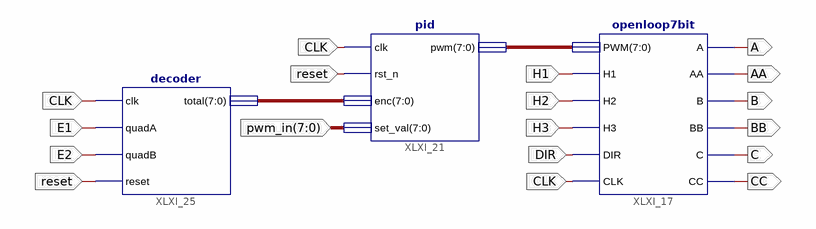
[diagram p0: schematic sheet 1]
// Xilinx ISE schematic my_protocol_7bit_pid.sch (spartan6) as structural Verilog: 3 symbols, 15 ports
module my_protocol_7bit_pid (
  input  [7:0] pwm_in,
  input  CLK,
  input  reset,
  input  DIR,
  input  H3,
  input  H2,
  input  H1,
  input  E2,
  input  E1,
  output CC,
  output C,
  output BB,
  output B,
  output AA,
  output A
);

  wire [7:0] XLXN_16, XLXN_143;

  openloop7bit XLXI_17 (
    .PWM(XLXN_143), .H1(H1), .H2(H2), .H3(H3), .DIR(DIR), .CLK(CLK), .A(A), .AA(AA), .B(B), .BB(BB), .C(C),
    .CC(CC));
  pid XLXI_21 (.clk(CLK), .rst_n(reset), .enc(XLXN_16), .set_val(pwm_in), .pwm(XLXN_143));
  decoder XLXI_25 (.clk(CLK), .quadA(E1), .quadB(E2), .reset(reset), .total(XLXN_16));
endmodule
